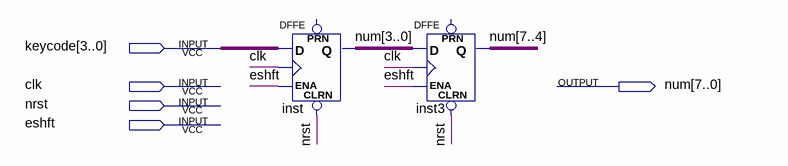
[diagram p0: schematic sheet]
// Quartus schematic registres.bdf as structural Verilog: 2 symbols, 5 pins
module registres (
  input  [3:0] keycode,
  input  clk,
  input  nrst,
  input  eshft,
  output [7:0] num
);

  DFFE inst[3:0] (.CLRN(nrst), .D(keycode), .CLK(clk), .ENA(eshft), .Q(num[3:0]));  // open: PRN
  DFFE inst3[3:0] (.CLRN(nrst), .D(num[3:0]), .CLK(clk), .ENA(eshft), .Q(num[7:4]));  // open: PRN
endmodule
